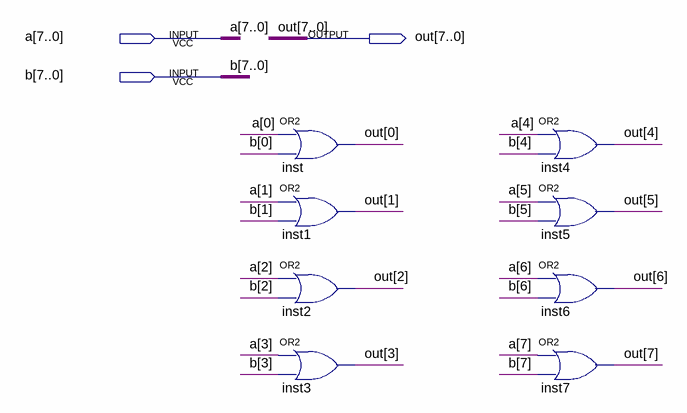
[diagram p0: schematic sheet]
// Quartus schematic or_gate.bdf as structural Verilog: 8 symbols, 3 pins
module or_gate (
  input  [7:0] a,
  input  [7:0] b,
  output [7:0] out
);

  or inst (out[0], a[0], b[0]);
  or inst1 (out[1], a[1], b[1]);
  or inst2 (out[2], a[2], b[2]);
  or inst3 (out[3], a[3], b[3]);
  or inst4 (out[4], a[4], b[4]);
  or inst5 (out[5], a[5], b[5]);
  or inst6 (out[6], a[6], b[6]);
  or inst7 (out[7], a[7], b[7]);
endmodule
